# Altium schematic sheet Output Connectors.SchDoc
size A4 portrait
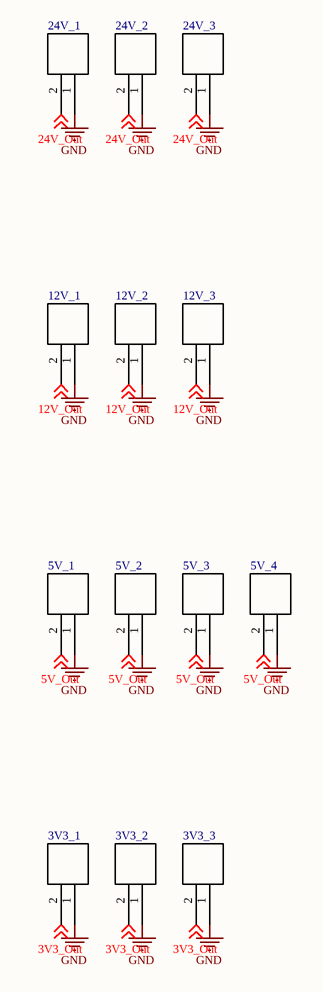
[diagram p0: Output Connectors.SchDoc]

## Parts
3V3_1  Molex 6.5MM  power connector  [power connector]  (value not drawn)
3V3_2  Molex 6.5MM  power connector  [power connector]  (value not drawn)
3V3_3  Molex 6.5MM  power connector  [power connector]  (value not drawn)
5V_1  Molex 6.5MM  power connector  [power connector]  (value not drawn)
5V_2  Molex 6.5MM  power connector  [power connector]  (value not drawn)
5V_3  Molex 6.5MM  power connector  [power connector]  (value not drawn)
5V_4  Molex 6.5MM  power connector  [power connector]  (value not drawn)
12V_1  Molex 6.5MM  power connector  [power connector]  (value not drawn)
12V_2  Molex 6.5MM  power connector  [power connector]  (value not drawn)
12V_3  Molex 6.5MM  power connector  [power connector]  (value not drawn)
24V_1  Molex 6.5MM  power connector  [power connector]  (value not drawn)
24V_2  Molex 6.5MM  power connector  [power connector]  (value not drawn)
24V_3  Molex 6.5MM  power connector  [power connector]  (value not drawn)

## Nets
GND: 3V3_1.1 3V3_2.1 3V3_3.1 5V_1.1 5V_2.1 5V_3.1 5V_4.1 12V_1.1 12V_2.1 12V_3.1 24V_1.1 24V_2.1 24V_3.1
3V3_Out: 3V3_1.2 3V3_2.2 3V3_3.2 ; off-sheet 3V3_Out
5V_Out: 5V_1.2 5V_2.2 5V_3.2 5V_4.2 ; off-sheet 5V_Out
12V_Out: 12V_1.2 12V_2.2 12V_3.2 ; off-sheet 12V_Out
24V_Out: 24V_1.2 24V_2.2 24V_3.2 ; off-sheet 24V_Out

## Notes on the sheet
- Title
- Size:
- Date:
- A4
- Number:
- Time:
- Revision:
- Sheet
- of
- File: